# Altium schematic sheet IO Power Supply.SchDoc
size A4; Organization: Altium Limited; Address1: L3, 12a Rodborough Rd; Address2: Frenchs Forest; Address3: NSW; Address4: Australia 2086
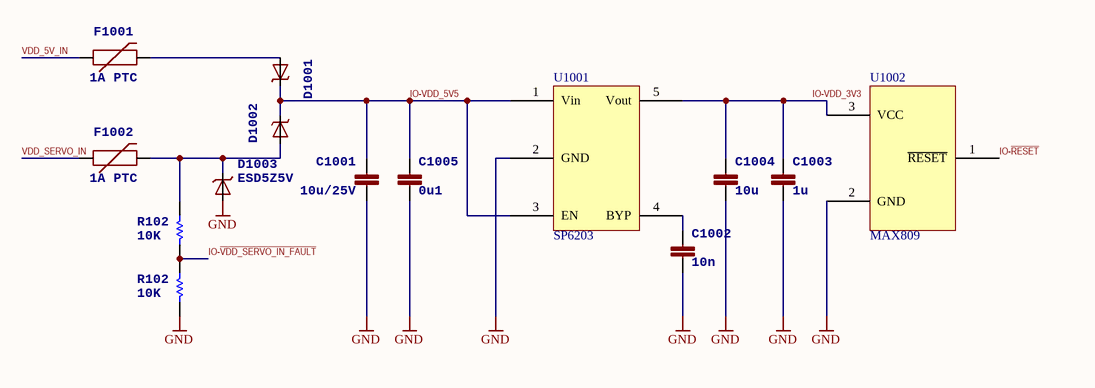
[diagram p0: IO Power Supply.SchDoc]

## Parts
C1001  >NAME: C1001  [0805-CAP]  (hidden comment: 10u/25V)
C1002  >NAME: C1002  [0603-CAP]  (hidden comment: 10n)
C1003  >NAME: C1003  [0603-CAP]  (hidden comment: 1u)
C1004  >NAME: C1004  [0805-CAP]  (hidden comment: 10u)
C1005  >NAME: C1005  [0603-CAP]  (hidden comment: 0u1)
D1001  SS14 SOD323  [SOD323]  (value not drawn)
D1002  SS14 SOD323  [SOD323]  (value not drawn)
D1003  ESD5Z5V  [SOD523]
F1001  >NAME: F1001  [PTC-1206]  (hidden comment: 1A PTC)
F1002  >NAME: F1002  [PTC-1206]  (hidden comment: 1A PTC)
R1001  >NAME: R102  [0603-RES]  (hidden comment: 10K)
R1002  >NAME: R102  [0603-RES]  (hidden comment: 10K)
U1001  SP6203  [SOT23-5]
U1002  MAX809  [SOT-23B_N]

## Nets
GND: C1001.P$2 C1002.P$2 C1003.P$2 C1004.P$2 C1005.P$2 D1003.A R1002.P$1 U1001.2(GND) U1002.2(GND)
IO-~{RESET}: U1002.1(~{RESET})
IO-~{VDD_SERVO_IN_FAULT}: R1001.P$1 R1002.P$2
IO-VDD_3V3: C1003.P$1 C1004.P$1 U1001.5(Vout) U1002.3(VCC)
IO-VDD_5V5: C1001.P$1 C1005.P$1 D1001.C D1002.C U1001.1(Vin) U1001.3(EN)
VDD_5V_IN: F1001.1
VDD_SERVO_IN: F1002.1
NetC1002_P$1: C1002.P$1 U1001.4(BYP)
NetD1001_A: D1001.A F1001.2
NetD1002_A: D1002.A D1003.C F1002.2 R1001.P$2

## Notes on the sheet
- Title
- Size:
- Date:
- A4
- Number:
- Time:
- Revision:
- Sheet
- of
- File:

## Library data of the parts
C1001 = CAP0805: <b>Capacitor</b> / Standard 0603 ceramic capacitor, and 0.1" leaded capacitor.; PARTNO: CL21A106KAYNNNE; >VALUE: 10u/25V
C1002 C1005 = CAP0402: <b>Capacitor</b> / Standard 0603 ceramic capacitor, and 0.1" leaded capacitor.; PARTNO: CC0402ZRY5V7BB104
  C1002: >VALUE: 10n
  C1005: >VALUE: 0u1
C1003 = CAP0603: <b>Capacitor</b> / Standard 0603 ceramic capacitor, and 0.1" leaded capacitor.; PARTNO: CC0603ZRY5V7BB105; >VALUE: 1u
C1004 = CAP0603: <b>Capacitor</b> / Standard 0603 ceramic capacitor, and 0.1" leaded capacitor.; PARTNO: C1608X5R1A106K080AC; >VALUE: 10u
D1001 D1002 = DIODE-SCHOTTKY_MSMP: Schottky barrier diode in DO214AC, e.g. Fairchild SS14.
D1003 = DIODE-TVS
F1001 F1002 = PTCSMD: <b>Resettable Fuse PTC</b> / Resettable Fuse. Spark Fun Electronics SKU : COM-08357; PARTNO: 1A PTC; >VALUE: 1A PTC
R1001 R1002 = RESISTOR0402-RES: <b>Resistor</b> / Basic schematic elements and footprints for 0603, 1206, and PTH 1/10th watt (small) resistors.; PARTNO: RC0402FR-0710KL; >VALUE: 10K
U1001 = SP6203: LDO with reset